# EAGLE design main (EAGLE 7.1.0)
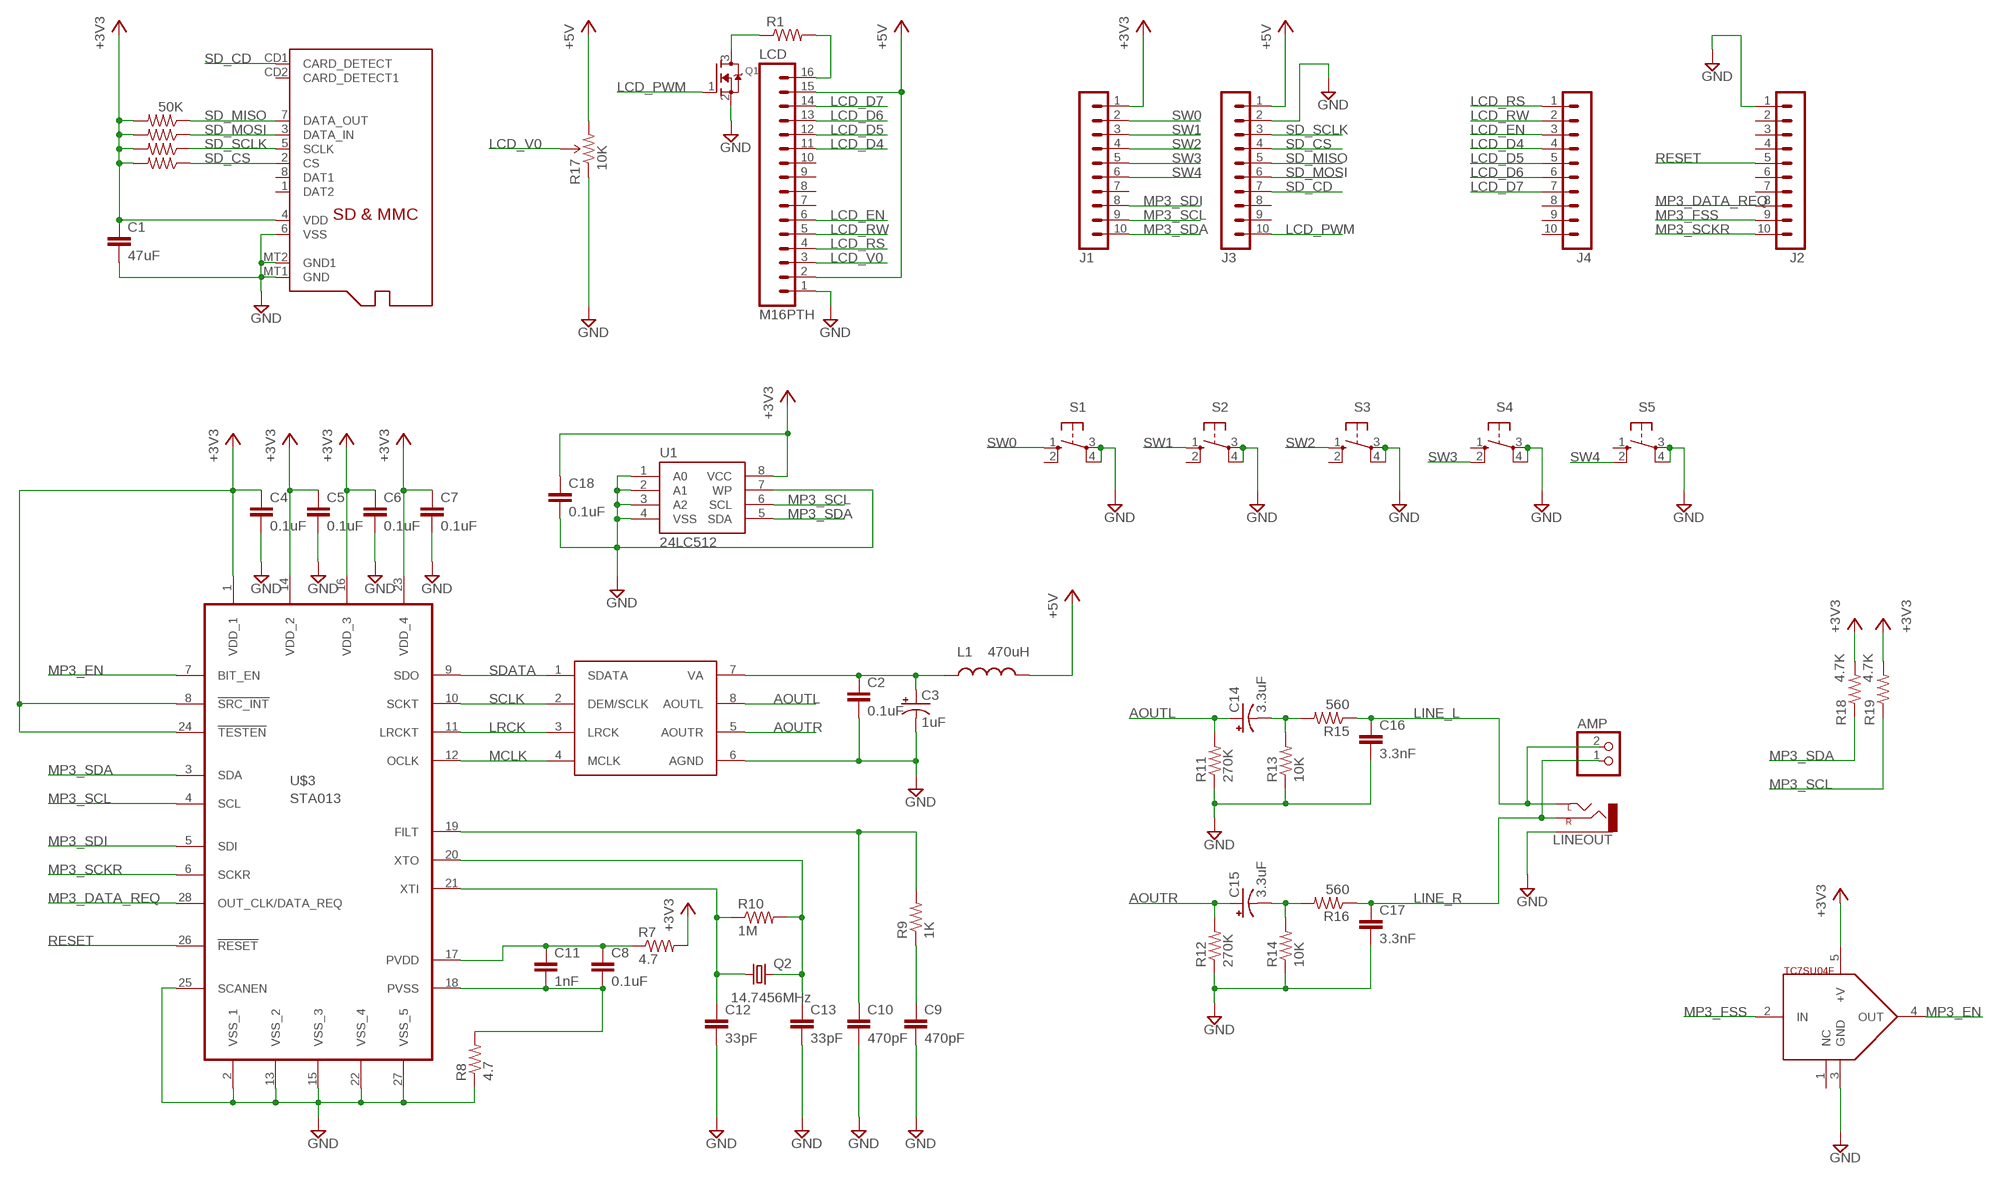
[diagram p0: schematic, sheet 1]

## Parts
AMP  JST_2PIN-THM-RA  [JST-PH-2-THM-RA]
C1  47uF  1.0UF-25V-+80/-20(0805)  [0805]
C2  0.1uF  1.0UF-25V-+80/-20(0805)  [0805]
C3  1uF  CAP_POL1206  [EIA3216]
C4  0.1uF  1.0UF-25V-+80/-20(0805)  [0805]
C5  0.1uF  1.0UF-25V-+80/-20(0805)  [0805]
C6  0.1uF  1.0UF-25V-+80/-20(0805)  [0805]
C7  0.1uF  1.0UF-25V-+80/-20(0805)  [0805]
C8  0.1uF  1.0UF-25V-+80/-20(0805)  [0805]
C9  470pF  1.0UF-25V-+80/-20(0805)  [0805]
C10  470pF  1.0UF-25V-+80/-20(0805)  [0805]
C11  1nF  1.0UF-25V-+80/-20(0805)  [0805]
C12  33pF  1.0UF-25V-+80/-20(0805)  [0805]
C13  33pF  1.0UF-25V-+80/-20(0805)  [0805]
C14  3.3uF  CAP_POL1206  [EIA3216]
C15  3.3uF  CAP_POL1206  [EIA3216]
C16  3.3nF  1.0UF-25V-+80/-20(0805)  [0805]
C17  3.3nF  1.0UF-25V-+80/-20(0805)  [0805]
C18  0.1uF  1.0UF-25V-+80/-20(0805)  [0805]
J1  MA10-1  [HEADER-10]
J2  MA10-1  [HEADER-10]
J3  MA10-1  [HEADER-10]
J4  MA10-1  [HEADER-10]
L1  470uH  INDUCTORSRR7032  [SRR7032]
LCD  M16PTH  [1X16]
LINEOUT  AUDIO-JACKPTH  [AUDIO-JACK]
Q1  MOSFET-NREFLOW  [SOT23]
Q2  14.7456MHz  CRYSTALHC49UP  [HC49UP]
R1  R-US_R0805  [R0805]
R3  50K  R-US_R0805  [R0805]
R4  50K  R-US_R0805  [R0805]
R5  50K  R-US_R0805  [R0805]
R6  50K  R-US_R0805  [R0805]
R7  4.7  R-US_R0805  [R0805]
R8  4.7  R-US_R0805  [R0805]
R9  1K  R-US_R0805  [R0805]
R10  1M  R-US_R0805  [R0805]
R11  270K  R-US_R0805  [R0805]
R12  270K  R-US_R0805  [R0805]
R13  10K  R-US_R0805  [R0805]
R14  10K  R-US_R0805  [R0805]
R15  560  R-US_R0805  [R0805]
R16  560  R-US_R0805  [R0805]
R17  10K  TRIMPOT3364W  [3364W]
R18  4.7K  R-US_R0805  [R0805]
R19  4.7K  R-US_R0805  [R0805]
S1  10-XX  [B3F-10XX]
S2  10-XX  [B3F-10XX]
S3  10-XX  [B3F-10XX]
S4  10-XX  [B3F-10XX]
S5  10-XX  [B3F-10XX]
U1  24LC512  EEPROM-I2CSMD  [SO08]
U$1  MICROSD  [MICROSD]
U$2  CS4334  [SO08]
U$3  STA013  [SO28W]
U$4  TC7SU04F  [SOT23-5]

## Nets
+3V3: C1.1 C4.1 C5.1 C6.1 C7.1 C18.1 J1.1 R3.2 R4.2 R5.2 R6.2 R7.2 R18.2 R19.2 U1.8(VCC) U$1.4(VDD) U$3.1(VDD_1) U$3.8(!SRC_INT) U$3.14(VDD_2) U$3.16(VDD_3) U$3.23(VDD_4) U$3.24(!TESTEN) U$4.5(+V)
+5V: J3.1 L1.P$2 LCD.2 LCD.15 R17.3(CW)
AOUTL: C14.A(+) R11.2 U$2.8(AOUTL)
AOUTR: C15.A(+) R12.2 U$2.5(AOUTR)
GND: C1.2 C2.2 C3.C(-) C4.2 C5.2 C6.2 C7.2 C9.2 C10.2 C12.2 C13.2 C16.2 C17.2 C18.2 J2.1 J3.2 LCD.1 LINEOUT.SLEEVE Q1.2(S) R8.1 R11.1 R12.1 R13.1 R14.1 R17.1(CCW) S1.3(P) S1.4(P1) S2.3(P) S2.4(P1) S3.3(P) S3.4(P1) S4.3(P) S4.4(P1) S5.3(P) S5.4(P1) U1.1(A0) U1.2(A1) U1.3(A2) U1.4(VSS) U1.7(WP) U$1.6(VSS) U$1.MT1(GND) U$1.MT2(GND1) U$2.6(AGND) U$3.2(VSS_1) U$3.13(VSS_2) U$3.15(VSS_3) U$3.22(VSS_4) U$3.25(SCANEN) U$3.27(VSS_5) U$4.3(GND)
LCD_D4: J4.4 LCD.11
LCD_D5: J4.5 LCD.12
LCD_D6: J4.6 LCD.13
LCD_D7: J4.7 LCD.14
LCD_EN: J4.3 LCD.6
LCD_PWM: J3.10 Q1.1(G)
LCD_RS: J4.1 LCD.4
LCD_RW: J4.2 LCD.5
LCD_V0: LCD.3 R17.2(WIPER)
LINE_L: AMP.2 C16.1 LINEOUT.TIP(LEFT) R15.1
LINE_R: AMP.1 C17.1 LINEOUT.RING(RIGHT) R16.1
LRCK: U$2.3(LRCK) U$3.11(LRCKT)
MCLK: U$2.4(MCLK) U$3.12(OCLK)
MP3_DATA_REQ: J2.8 U$3.28(OUT_CLK/DATA_REQ)
MP3_EN: U$3.7(BIT_EN) U$4.4(OUT)
MP3_FSS: J2.9 U$4.2(IN)
MP3_SCKR: J2.10 U$3.6(SCKR)
MP3_SCL: J1.9 R19.1 U1.6(SCL) U$3.4(SCL)
MP3_SDA: J1.10 R18.1 U1.5(SDA) U$3.3(SDA)
MP3_SDI: J1.8 U$3.5(SDI)
N$1: LCD.16 R1.2
N$2: Q1.3(D) R1.1
N$3: C8.2 C11.2 R8.2 U$3.18(PVSS)
N$4: C8.1 C11.1 R7.1 U$3.17(PVDD)
N$5: C12.1 Q2.1 R10.1 U$3.21(XTI)
N$6: C13.1 Q2.2 R10.2 U$3.20(XTO)
N$7: C10.1 R9.2 U$3.19(FILT)
N$8: C9.1 R9.1
N$9: C2.1 C3.A(+) L1.P$1 U$2.7(VA)
N$10: C14.C(-) R13.2 R15.2
N$12: C15.C(-) R14.2 R16.2
RESET: J2.5 U$3.26(!RESET)
SCLK: U$2.2(DEM/SCLK) U$3.10(SCKT)
SD_CD: J3.7 U$1.CD1(CARD_DETECT)
SD_CS: J3.4 R6.1 U$1.2(CS)
SD_MISO: J3.5 R3.1 U$1.7(DATA_OUT)
SD_MOSI: J3.6 R4.1 U$1.3(DATA_IN)
SD_SCLK: J3.3 R5.1 U$1.5(SCLK)
SDATA: U$2.1(SDATA) U$3.9(SDO)
SW0: J1.2 S1.1(S)
SW1: J1.3 S2.1(S)
SW2: J1.4 S3.1(S)
SW3: J1.5 S4.2(S1)
SW4: J1.6 S5.2(S1)
Unconnected: J1.7 J2.2 J2.3 J2.4 J2.6 J2.7 J3.8 J3.9 J4.8 J4.9 J4.10 LCD.7 LCD.8 LCD.9 LCD.10 S1.2(S1) S2.2(S1) S3.2(S1) S4.1(S) S5.1(S) U$1.1(DAT2) U$1.8(DAT1) U$1.CD2(CARD_DETECT1) U$4.1(NC)

## Library data of the parts
AMP = adafruit:JST_2PIN: JST 2-Pin Connectors of various flavors SMT-RA (S2B-PH-SM4) 4UConnector #17311 SMT (B2B-PH-SM4) THM-RA (S2B-PH) THM (B2B-PH)
C1 C2 C4-C13 C16-C18 = SparkFun-Capacitors:1.0UF-25V-+80/-20(0805): CAP-11625; PROD_ID: CAP-11625; VALUE: 1.0uF
C3 C14 C15 = SparkFun-Capacitors:CAP_POL: Capacitor Polarized These are standard SMD and PTH capacitors. Normally 10uF, 47uF, and 100uF in electrolytic and tantalum varieties. Always verify the external diameter of the through hole cap, it varies with capacity, voltage, and manufacturer. The EIA devices should be standard.
J1-J4 = custom-spave:MA10-1: PIN HEADER
L1 = custom-spave:INDUCTOR: Inductors Basic Inductor/Choke - 0603 and 1206. Footprints are not proven and vary greatly between part numbers. SRN6045- 33uH, 20% 1.4A SDR0403-560KL - 56uH, 10%, 500mA RMS/740mA peak
LCD = SparkFun-Connectors:M16: 1x16 .1" header
LINEOUT = SparkFun-Connectors:AUDIO-JACK: 3.5mm Audio Jack Simple 3.5mm common PCB mount audio jack. SKU: PRT-08032
Q1 = adafruit:MOSFET-N: N-Channel Mosfet 2N7002E - 60V 260mA SOT23 [Digikey: 2N7002ET1GOSTR-ND] - REEL BSH103 - 30V 850mA SOT23 [Digikey: 568-5013-1-ND]
Q2 = adafruit:CRYSTAL: CRYSTAL; OC_FARNELL: unknown; OC_NEWARK: unknown
R1 R3-R16 R18 R19 = adafruit:R-US_: RESISTOR, American symbol
R17 = custom-spave:TRIMPOT: Various small potentiometers for "set-and-forget" applications
S1-S5 = switch-omron:10-XX: OMRON SWITCH; MPN: B3F-1000; OC_FARNELL: 176432; OC_NEWARK: 36M3542
U1 = SparkFun-DigitalIC:EEPROM-I2C: I2C EEPROM chips, 24LC256 (and others)
U$1 = adafruit:MICROSD: Micro-SD / Transflash card holder with SPI pinout For the 3M # 2908-05WB-MG and/or 4UCON #19656 push-push type
U$2 = custom-spave:CS4334: 8-SOIC NMOSFET
U$3 = custom-spave:STA013
U$4 = SparkFun-DigitalIC:TC7SU04F: Single gate inverter

## Net classes
0 default: width 0.203 mm

## Board
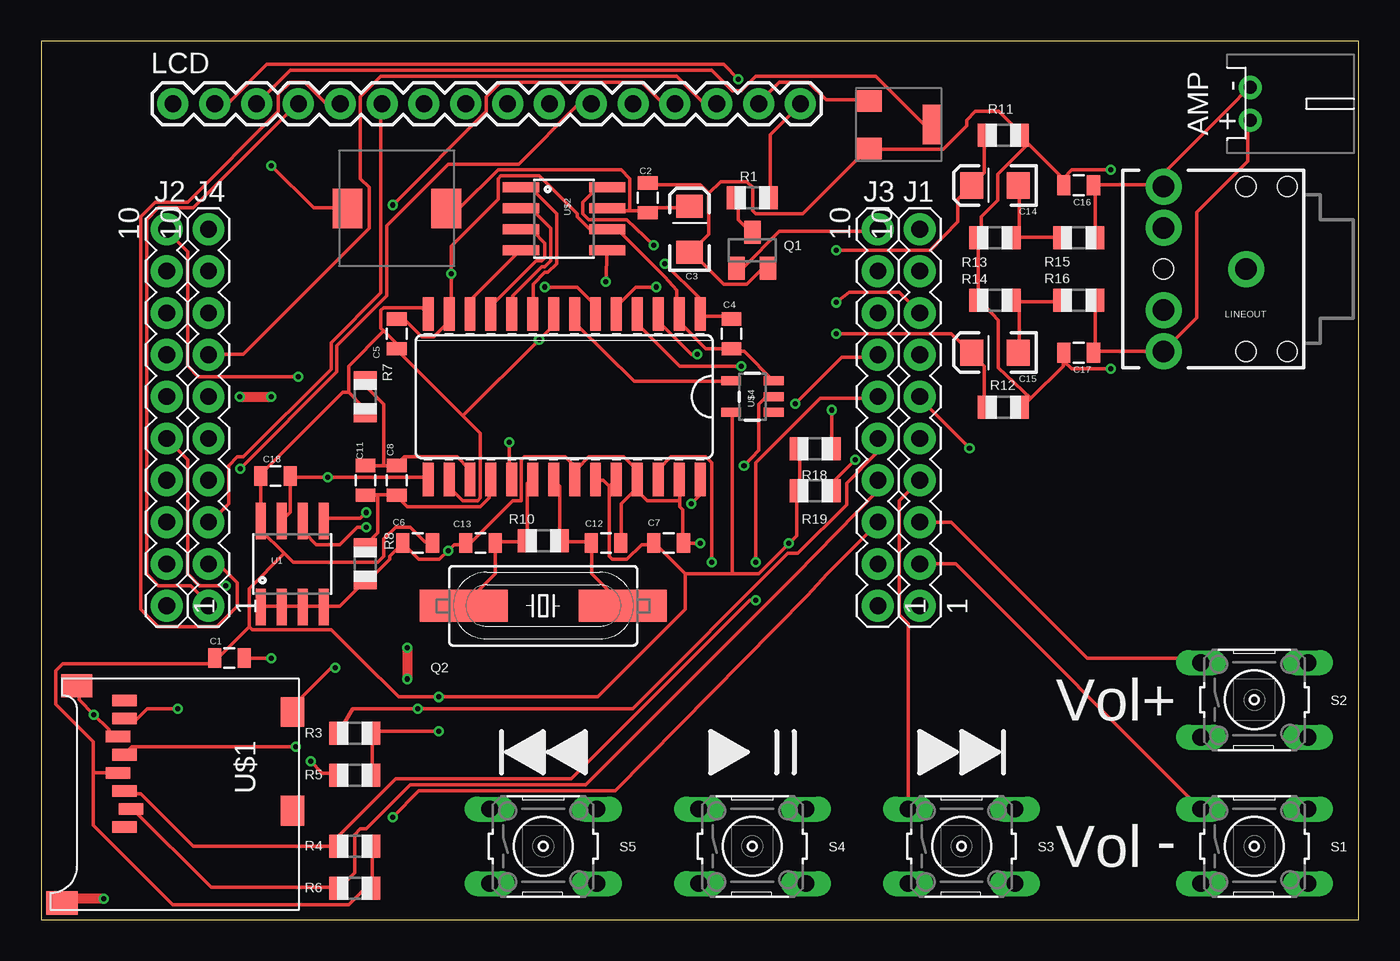
[diagram p1: board, top side]
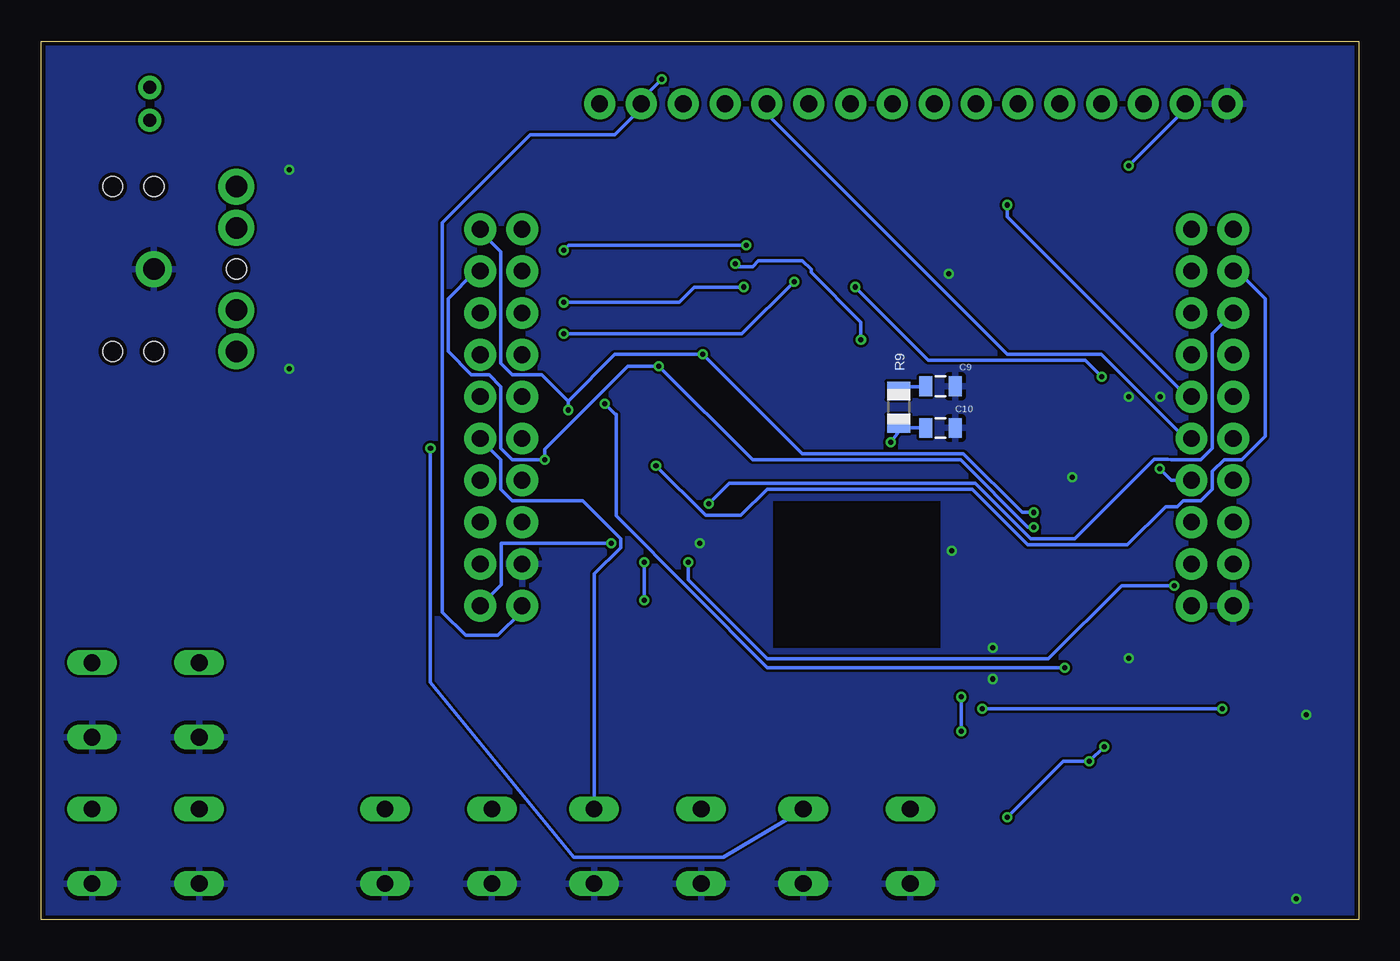
[diagram p2: board, bottom side, seen from below]

Size 80 x 53.33 mm. Coordinates in mm from the lower left corner, seen from the top.
Outline: 0,0 80,0 80,53.33 0,53.33 0,0
Copper layers (1*16): Top 0.035mm / dielectric 1.5mm / Bottom 0.035mm
Design rules "ITEADstudio_DRC": minimum track width 6mil, minimum drill 12mil, track to track 6mil, track to pad 6mil, pad to pad 6mil, via to via 6mil, smd to smd 0mil, copper to edge 10mil, drill to drill 10mil, minimum pad ring 10mil, minimum via ring 6mil, stop-mask expansion 2mil, vias tented up to drill 100mil, thermal gap 10mil
bRestrict: area 25.4,16.5 to 35.6,25.4

### Footprints (pad centres in the part's own frame; a part is rotated, then mirrored left to right if it is on the bottom)
JST-PH-2-THM-RA = drill 0.8 pad 1.422: 1 1,0; 2 -1,0
0805 = smd 0.8 x 1.2: 1 -0.9,0; 2 0.9,0
EIA3216 = smd 1.4 x 1.6: A 1.4,0; C -1.4,0
HEADER-10 = drill 1.016 pad 1.93: 1 -11.43,0; 2 -8.89,0; 3 -6.35,0; 4 -3.81,0; 5 -1.27,0; 6 1.27,0; 7 3.81,0; 8 6.35,0; 9 8.89,0; 10 11.43,0
SRR7032 = smd 2.4 x 1.8: P$1 0,3; P$2 0,-3
1X16 = drill 1.016 pad 1.88: 1 0,0; 2 2.54,0; 3 5.08,0; 4 7.62,0; 5 10.16,0; 6 12.7,0; 7 15.24,0; 8 17.78,0; 9 20.32,0; 10 22.86,0; 11 25.4,0; 12 27.94,0; 13 30.48,0; 14 33.02,0; 15 35.56,0; 16 38.1,0
AUDIO-JACK = drill 1.3 pad 2.184: RING 5,5; RSH 5,2.5; SLEEVE 0,0; TIP 5,-5; TSH 5,-2.5 | hole 1.2: 0,5; -2.5,5; -2.5,-5; 0,-5; 5,0
SOT23 = smd 1 x 1.4: 1 -0.95,-1.1; 2 0.95,-1.1; 3 0,1.1
HC49UP = smd 5.334 x 1.93: 1 -4.826,0; 2 4.826,0
R0805 = smd 1.1 x 1.4: 1 -1,0; 2 1,0
3364W = smd 1.3 x 1.5: 1 1.45,-1.8; 3 -1.45,-1.8 | smd 2.4 x 1.1: 2 0,2
B3F-10XX = drill 1.016 long: 1 -3.251,2.261; 2 3.251,2.261; 3 -3.251,-2.261; 4 3.251,-2.261
SO08 = smd 0.61 x 2.21: 1 -1.905,-2.616; 2 -0.635,-2.616; 3 0.635,-2.616; 4 1.905,-2.616; 5 1.905,2.616; 6 0.635,2.616; 7 -0.635,2.616; 8 -1.905,2.616
MICROSD = smd 0.7 x 1.5: 1 9,-10.64; 2 7.9,-10.24; 3 6.8,-10.64; 4 5.7,-11.04; 5 4.6,-10.64; 6 3.5,-11.04; 7 2.4,-10.64; 8 1.3,-10.64 | smd 1.8 x 1.4: CD1 2,-0.44; CD2 8,-0.44 | smd 1.4 x 1.9: MT1 0.4,-13.54; MT2 13.6,-14.44
SO28W = smd 0.66 x 2.032: 1 -8.255,-5.029; 2 -6.985,-5.029; 3 -5.715,-5.029; 4 -4.445,-5.029; 5 -3.175,-5.029; 6 -1.905,-5.029; 7 -0.635,-5.029; 8 0.635,-5.029; 9 1.905,-5.029; 10 3.175,-5.029; 11 4.445,-5.029; 12 5.715,-5.029; 13 6.985,-5.029; 14 8.255,-5.029; 15 8.255,5.029; 16 6.985,5.029; 17 5.715,5.029; 18 4.445,5.029; 19 3.175,5.029; 20 1.905,5.029; 21 0.635,5.029; 22 -0.635,5.029; 23 -1.905,5.029; 24 -3.175,5.029; 25 -4.445,5.029; 26 -5.715,5.029; 27 -6.985,5.029; 28 -8.255,5.029
SOT23-5 = smd 0.55 x 1.2: 1 -0.95,-1.3; 2 0,-1.3; 3 0.95,-1.3; 4 0.95,1.3; 5 -0.95,1.3

### Placement (x,y rotation side)
AMP  73.41,49.53 270 top
C1  11.43,15.88 0 top
C2  36.83,43.81 90 top
C3  39.37,41.91 90 top
C4  41.91,35.56 270 top
C5  21.59,35.56 90 top
C6  22.86,22.86 180 top
C7  38.1,22.86 0 top
C8  21.59,26.67 270 top
C9  25.4,32.38 0 bottom
C10  25.4,29.84 0 bottom
C11  19.68,26.67 270 top
C12  34.29,22.86 0 top
C13  26.67,22.86 180 top
C14  57.91,44.58 180 top
C15  57.91,34.42 180 top
C16  62.99,44.58 180 top
C17  62.99,34.42 180 top
C18  14.22,26.92 0 top
J1  53.34,30.48 90 top
J2  7.62,30.48 90 top
J3  50.8,30.48 90 top
J4  10.16,30.48 90 top
L1  21.59,43.18 270 top
LCD  8,49.53 0 top
LINEOUT  73.15,39.5 180 top
Q1  43.18,40.64 0 top
Q2  30.48,19.05 180 top
R1  43.18,43.81 0 top
R3  19.05,11.3 0 top
R4  19.05,4.45 0 top
R5  19.05,8.76 0 top
R6  19.05,1.91 0 top
R7  19.68,31.75 270 top
R8  19.68,21.59 90 top
R9  27.94,31.11 270 bottom
R10  30.48,22.99 180 top
R11  58.42,47.62 180 top
R12  58.42,31.11 180 top
R13  57.91,41.4 0 top
R14  57.91,37.59 0 top
R15  62.99,41.4 180 top
R16  62.99,37.59 180 top
R17  52.07,48.26 270 top
R18  46.99,28.57 180 top
R19  46.99,26.04 180 top
S1  73.66,4.45 0 top
S2  73.66,13.34 0 top
S3  55.88,4.45 0 top
S4  43.18,4.45 0 top
S5  30.48,4.45 0 top
U1  15.24,21.59 0 top
U$1  15.7,14.61 270 top
U$2  31.75,42.55 270 top
U$3  31.75,31.75 180 top
U$4  43.18,31.75 90 top

### Tracks (layer width: path | path; a pad name or v marks a point on that pad's centre or on a via)
+3V3  (via drill 0.3)
  Top 0.203: 41.96,36.45 C4.1 41.78,36.63 40.01,36.63 U$3.1 40.01,37.69 v37.87,39.83 | R18.2 46.05,28.45 46.05,26.14 R19.2 45.87,25.96 45.87,23.29 45.58,23 | 34.49,26.31 34.49,22.05 34.67,21.87 35.56,21.87 36.45,22.76 37.16,22.76 C7.1 37.34,22.76 39.12,20.98 | 34.49,26.31 34.85,26.67 U$3.24 | 34.49,26.31 34.14,26.67 33.78,26.67 U$3.23 | 45.58,23 43.56,20.98 41.96,20.98 | 39.12,20.98 41.96,20.98 | 41.96,20.98 41.96,30.76 U$4.5 | 20.8,35.74 20.62,35.92 20.62,36.98 20.8,37.16 23.11,37.16 U$3.14 | 20.8,35.74 21.51,35.03 21.51,34.67 C5.1 21.69,34.49 25.6,30.58 | 18.67,32 19.56,31.11 19.56,30.76 R7.2 | 18.67,32 18.67,33.6 20.8,35.74 | 25.6,30.58 26.67,29.52 26.67,25.6 26.49,25.43 25.6,25.43 24.89,26.14 24.89,26.67 U$3.16 | U$3.8 31.11,36.09 v30.23,35.2 25.6,30.58 | R5.2 20.09,8.89 20.09,11.2 R3.2 20.09,11.38 20.45,11.38 19.81,11.56 20.32,11.43 v24.13,11.43 | R4.2 20.09,4.45 20.09,1.96 R6.2 19.91,1.78 19.56,1.78 18.67,0.89 8,0.89 3.17,5.71 3.17,8.9 | 14.76,22.23 13.34,23.65 U1.8 13.34,26.85 C18.1 13.34,27.03 18.31,32 18.67,32 | 14.76,22.23 15.29,21.69 20.45,21.69 20.8,22.05 20.8,23.11 21.51,23.82 22.4,23.82 23.29,22.94 23.65,22.94 C6.1 | 12.62,17.78 12.8,17.6 17.6,17.6 19.91,15.29 21.18,14.05 21.72,13.51 v24.13,13.51 33.78,13.51 39.12,18.85 39.12,20.98 | 12.62,17.78 12.62,20.09 14.76,22.23 | 3.17,8.9 3.17,10.79 0.89,13.08 0.89,15.11 1.29,15.52 3.81,15.52 | 3.81,15.52 10.36,15.52 10.72,15.88 | 12.62,17.78 10.72,15.88 | v45.39,22.86 45.53,23 45.58,23 | U$1.4 3.17,8.9 | 3.8,15.53 3.81,15.52 | C1.1 10.72,15.88
  Bottom 0.203: J1.1 52.07,20.32 52.07,22.86 v45.39,22.86 | v24.13,13.51 v24.13,11.43 | v30.23,35.2 30.23,36.27 33.25,39.29 33.25,39.47 33.78,40.01 36.45,40.01 36.8,39.65 37.69,39.65 v37.87,39.83
+5V  (via drill 0.3)
  Top 0.203: v13.97,45.77 16.54,43.2 18.49,43.2 L1.P$2 | R17.3 50.14,49.78 47.65,49.78 46.58,50.85 44.81,50.85 43.56,49.61 LCD.15 | v42.32,51.03 41.43,51.92 13.69,51.92 11.38,49.61 10.67,49.61 LCD.2
  Bottom 0.203: v13.97,45.77 10.67,49.07 10.67,49.43 LCD.2 | J3.1 50.85,19.02 50.85,18.67 52.27,17.25 54.23,17.25 55.65,18.67 55.65,42.32 50.32,47.65 45.16,47.65 43.38,49.43 LCD.15 43.38,49.61 43.38,49.96 v42.32,51.03
AOUTL  (via drill 0.3)
  Top 0.203: R11.2 57.25,47.47 57.25,45.34 56.54,44.63 C14.A 56.36,44.45 55.65,43.74 55.65,42.37 53.98,40.64 v48.26,40.64 | U$2.8 33.78,44.45 32.89,43.56 32.89,42.85 33.25,42.49 35.56,42.49 v37.19,40.95
  Bottom 0.203: v48.26,40.64 47.95,40.95 v37.19,40.95
AOUTR  (via drill 0.3)
  Top 0.203: R12.2 57.25,31.11 57.25,33.6 56.54,34.31 C15.A 55.24,35.56 v48.26,35.56 | v34.29,38.73 U$2.5
  Bottom 0.203: v48.26,35.56 37.47,35.56 v34.29,38.73
GND  (via drill 0.3)
  Top 0.203: U1.1 13.34,19.02 14.58,19.02 U1.2 14.76,19.02 15.82,19.02 U1.3 16,19.02 17.07,19.02 U1.4 17.25,19.02 18.14,19.02 19.56,20.45 R8.1 19.74,20.45 21.16,21.87 21.16,22.05 21.87,22.76 C6.2 22.05,22.76 22.94,21.87 24.18,21.87 v24.71,22.4 25.07,22.76 25.6,22.76 C13.2 25.78,22.94 26.14,22.94 28.63,25.43 29.16,25.43 29.16,27.91 29.34,28.09 31.83,28.09 32.54,27.38 | 38.76,25.43 38.76,26.67 U$3.27 | 38.76,25.43 38.76,25.07 38.94,24.89 38.94,22.94 C7.2 v40.01,22.86 | 36.09,26.14 35.2,25.25 35.2,22.94 C12.2 | 36.09,26.14 36.09,26.67 U$3.25 | 32.54,27.38 32.54,26.85 U$3.22 32.54,27.38 | 32.54,27.38 33.25,28.09 35.38,28.09 36.09,27.38 | 36.09,27.38 36.09,26.85 U$3.25 | 38.76,25.43 36.8,25.43 36.09,26.14 | 36.09,26.14 U$3.25 | C5.2 21.69,36.45 22.05,36.45 23.11,35.38 23.82,35.38 24.71,36.27 24.71,36.63 U$3.13 24.89,36.8 v24.89,39.22 24.89,40.89 27.74,43.74 27.74,44.98 27.91,45.16 30.23,45.16 32.54,42.85 32.54,42.67 33.25,41.96 34.31,41.96 U$2.6 34.49,41.78 35.1,41.78 37.87,39.01 38.58,38.2 38.58,36.8 U$3.2 38.76,36.63 38.76,36.27 40.36,34.67 41.78,34.67 C4.2 41.96,34.49 42.67,34.49 44.45,32.72 U$4.3 | 36.09,27.38 U$3.25 | U1.7 15.11,24.71 15.11,26.85 C18.2 15.29,26.85 v17.4,26.85 23.47,26.85 U$3.15 | 40.54,44.09 40.01,44.63 36.98,44.63 C2.2 | 40.54,44.09 40.54,41.6 39.47,40.54 | 39.47,40.54 41.43,38.58 42.85,38.58 43.74,39.47 44.09,39.47 Q1.2 | 39.47,40.54 C3.C | U$1.6 4.62,11.2 4.27,10.92 4.09,11.56 v3.2,12.45 2.31,13.34 2.31,14.05 U$1.MT1 | 60.1,31.65 59.56,31.11 R12.1 | 60.1,31.65 62.05,33.6 62.05,34.31 C17.2 | 62.05,44.98 62.05,44.63 C16.2 62.05,44.98
  Top 0.203: 59.92,47.12 59.56,47.47 R11.1 | 59.92,47.12 62.05,44.98 | v64.95,45.52 62.59,45.52 62.05,44.98 | R11.1 59.56,47.65 58.14,49.07 56.72,49.07 56.19,48.54 56.19,48.18 54.76,46.76 50.32,46.76 R17.1 50.14,46.76 46.23,42.85 43.38,42.85 43.2,43.03 43.2,44.45 42.85,44.81 41.25,44.81 40.54,44.09 | 1.25,1.07 U$1.MT2 | 59.92,47.12 58.06,45.26 58.06,43.66 57.07,42.67 57.07,41.43 R13.1 56.9,41.25 56.9,37.69 R14.1 57.07,37.52 58.12,36.4 58.12,33.5 60.1,31.65 | 59.92,47.12 R11.1 | v64.95,33.45 62.59,33.45 62.08,33.88 | C1.2 v13.97,15.88
  Top 0.61: v12.06,31.75 v13.97,31.75 | v22.23,16.51 v22.23,14.61 | v3.81,1.27 1.91,1.27 U$1.MT2
  pour Bottom: -1.27,54.61 -1.27,-1.27 81.28,-1.27 81.28,54.61
LCD_D4  (via drill 0.3)
  Top 0.203: v12.09,27.38 17.96,33.25 17.96,34.85 20.98,37.87 20.98,42.14 24.71,45.87 28.98,45.87 32.54,49.43 33.25,49.43 LCD.11
  Bottom 0.203: v12.09,27.38 11.38,26.67 J4.4
LCD_D5
  Bottom 0.203: LCD.12 35.92,49.43 35.92,48.9 21.34,34.31 15.65,34.31 10.67,29.34 10.31,29.34 J4.5
LCD_D6  (via drill 0.3)
  Top 0.203: v21.34,43.38 27.03,49.07 27.03,49.96 27.91,50.85 36.45,50.85 37.69,49.61 38.41,49.61 LCD.13
  Bottom 0.203: v21.34,43.38 21.34,42.67 10.31,31.65 J4.6
LCD_D7
  Top 0.203: LCD.14 40.89,49.61 40.18,49.61 38.58,51.21 20.62,51.21 19.38,49.96 19.38,44.98 19.91,44.45 19.91,41.96 12.27,34.31 10.31,34.31 J4.7
LCD_EN
  Top 0.203: LCD.6 20.62,49.43 20.62,38.05 17.6,35.03 17.6,33.43 12.27,28.09 11.91,28.09 11.38,27.56 11.38,25.25 10.31,24.18 J4.3
LCD_PWM
  Top 0.203: Q1.1 42.32,39.65 42.67,39.65 44.81,41.78 50.67,41.78 J3.10
LCD_RS
  Top 0.203: LCD.4 15.47,49.43 9.25,43.2 7.11,43.2 6.4,42.49 6.4,20.98 7.11,20.27 9.07,20.27 10.13,19.2 J4.1
LCD_RW
  Top 0.203: LCD.5 18.14,49.61 17.25,49.61 16,50.85 15.11,50.85 14.4,50.14 14.4,49.07 8.89,43.56 6.93,43.56 6.04,42.67 6.04,18.85 7.11,17.78 10.67,17.78 11.91,19.02 11.91,20.45 10.85,21.51 10.31,21.51 J4.2
LCD_V0
  Top 0.203: R17.2 54.05,48.36 53.52,48.36 50.67,51.21 43.38,51.21 42.49,50.32 41.96,50.32 40.72,51.56 15.11,51.56 13.16,49.61 LCD.3
LINE_L
  Top 0.203: R15.1 64.01,41.43 64.01,44.45 C16.1 64.01,44.63 67.46,44.63 | 67.46,44.63 72.62,49.78 73.25,50.49 AMP.2 | 67.46,44.63 LINEOUT.TIP
LINE_R
  Top 0.203: 64.01,34.49 64.01,37.52 R16.1 | 64.01,34.49 68.1,34.49 LINEOUT.RING 68.28,34.67 70.16,36.55 70.16,42.95 73.25,46.05 73.25,48.36 AMP.1 | 64.01,34.49 C17.1
LRCK
  Top 0.203: U$3.11 27.38,36.8 27.38,37.34 30.05,40.01 30.4,40.01 30.58,40.18 30.58,41.07 29.87,41.78 29.16,41.78 U$2.3
MCLK
  Top 0.203: U$3.12 26.14,36.8 26.14,37.69 28.98,40.54 U$2.4
MP3_DATA_REQ  (via drill 0.3)
  Top 0.203: U$3.28 40.01,25.78 v39.47,25.25
  Bottom 0.203: v39.47,25.25 38.23,26.49 23.29,26.49 19.91,23.11 17.25,23.11 12.42,27.94 11.61,27.94 11.38,27.91 9.6,27.91 8.89,28.63 8.89,35.56 J2.8
MP3_EN
  Top 0.203: U$3.7 32.54,36.63 32.54,36.09 36.02,32.69 41.97,32.69 U$4.4
MP3_FSS  (via drill 0.3)
  Top 0.203: v42.67,27.56 43.56,28.5 43.56,31.29 43.92,31.65 44.45,31.65 U$4.2
  Bottom 0.203: v42.67,27.56 39.65,24.54 37.52,24.54 35.92,26.14 23.47,26.14 20.09,22.76 14.05,22.76 11.73,25.07 11.02,25.07 10.67,25.43 9.6,25.43 8.89,26.14 8.89,27.2 8.18,27.91 7.11,27.91 5.69,29.34 5.69,37.69 7.47,39.47 J2.9
MP3_SCKR  (via drill 0.3)
  Top 0.203: v30.58,38.41 32.54,38.41 33.6,37.34 33.6,36.8 U$3.6 | v15.62,32.97 9.55,32.97 8.89,33.63 8.89,40.54 7.64,41.78 J2.10
  Bottom 0.203: v30.58,38.41 26.14,33.96 16.61,33.96 v15.62,32.97
MP3_SCL  (via drill 0.3)
  Top 0.203: v49.43,27.91 48.01,26.49 48.01,26.14 R19.1 | v42.49,33.6 38.76,33.6 36.27,36.09 36.27,36.63 U$3.4 | v19.74,23.82 19.2,23.82 18.14,22.76 16.71,22.76 16,23.47 16,24.18 U1.6
  Bottom 0.203: J1.9 53.34,39.29 53.7,39.29 55.3,37.69 55.3,34.49 53.87,33.07 52.81,33.07 52.09,32.36 52.09,28.63 51.38,27.91 v49.43,27.91 49.43,28.55 44.37,33.6 v42.49,33.6 36.8,27.91 24.18,27.91 20.09,23.82 v19.74,23.82
MP3_SDA  (via drill 0.3)
  Top 0.203: v48.01,30.94 48.01,28.63 R18.1 | v39.83,34.31 39.47,34.31 37.52,36.27 37.52,36.63 U$3.3 | v19.74,24.71 19.38,24.36 17.25,24.36 U1.5
  Bottom 0.203: 48.01,31.47 v48.01,30.94 | 48.01,31.47 49.61,33.07 51.38,33.07 52.09,33.78 52.09,40.54 53.34,41.78 J1.10 | 48.01,31.47 45.16,34.31 v39.83,34.31 33.78,28.27 24,28.27 20.45,24.71 v19.74,24.71
MP3_SDI  (via drill 0.3)
  Top 0.203: v37.34,38.41 36.09,38.41 35.03,37.34 35.03,36.8 U$3.5 | J1.8 53.34,36.8 52.09,38.1 49.05,38.1 v48.26,37.47
  Bottom 0.203: v37.34,38.41 40.34,38.41 41.27,37.47 v48.26,37.47
N$1
  Top 0.203: R1.2 44.27,43.92 44.27,47.65 46.05,49.43 LCD.16
N$2
  Top 0.203: R1.1 42.32,43.74 42.32,42.49 43.03,41.78 Q1.3
N$3
  Top 0.203: 20.45,25.78 21.51,25.78 C8.2 21.69,25.6 22.23,25.07 26.67,25.07 27.2,25.6 27.2,26.67 U$3.18 | 20.45,25.78 19.74,25.78 C11.2 | 20.45,25.78 20.45,23.47 19.74,22.76 R8.2
N$4
  Top 0.203: 20.8,27.56 21.51,27.56 C8.1 21.69,27.74 22.05,28.09 25.25,28.09 25.96,27.38 25.96,26.85 U$3.17 | 20.8,27.56 19.74,27.56 C11.1 | 20.8,27.56 20.8,31.29 19.74,32.36 19.74,32.72 R7.1
N$5
  Top 0.203: U$3.21 31.11,26.67 31.47,26.31 31.47,23.11 R10.1 31.65,22.94 33.25,22.94 C12.1 33.43,22.76 33.43,20.98 35.2,19.2 Q2.1
N$6
  Top 0.203: U$3.20 29.69,26.67 29.52,26.49 29.52,23.11 R10.2 29.34,22.94 27.74,22.94 C13.1 27.56,22.76 27.56,20.98 25.78,19.2 Q2.2
N$7  (via drill 0.3)
  Top 0.203: v28.42,28.98 28.42,28.09 28.45,27.38 28.45,26.85 U$3.19
  Bottom 0.203: 27.74,29.87 26.31,29.87 C10.1 | 27.74,29.87 27.91,30.05 R9.2 27.74,29.87 | v28.42,28.98 27.74,29.87
N$8
  Bottom 0.203: C9.1 26.31,32.36 27.74,32.36 27.91,32.18 R9.1
N$9
  Top 0.203: 35.74,43.03 34.49,43.03 U$2.7 | 35.74,43.03 36.8,43.03 C2.1 36.98,43.03 37.16,43.2 39.29,43.2 C3.A | 35.74,43.03 35.74,44.98 35.2,45.52 27.74,45.52 25.43,43.2 24.71,43.2 L1.P$1
N$10
  Top 0.203: 59.38,41.43 61.87,41.43 R15.2 | 59.38,41.43 59.03,41.43 R13.2 59.38,41.43 | 59.38,41.43 59.38,44.45 C14.C
N$12
  Top 0.203: 59.38,37.52 61.87,37.52 R16.2 | 59.38,37.52 59.03,37.52 R14.2 59.38,37.52 | 59.38,37.52 59.38,34.49 C15.C
RESET  (via drill 0.3)
  Top 0.203: v40.72,21.69 40.72,27.74 40.36,28.09 38.23,28.09 37.52,27.38 37.52,26.85 U$3.26 | v11.2,20.27 9.6,20.27 8.89,20.98 8.89,27.91 7.64,29.16 J2.5
  Bottom 0.203: v40.72,21.69 40.72,20.62 35.92,15.82 18.85,15.82 14.4,20.27 v11.2,20.27
SCLK
  Top 0.203: U$3.10 28.63,36.8 28.63,37.87 30.4,39.65 30.58,39.65 30.94,40.01 30.94,41.96 29.87,43.03 29.16,43.03 U$2.2
SD_CD  (via drill 0.3)
  Top 0.203: v17.86,15.29 17.6,15.29 15.29,12.98 15.29,12.62 U$1.CD1 | v45.77,31.32 46.76,32.28 48.62,34.14 50.67,34.14 J3.7
  Bottom 0.203: v17.86,15.29 35.92,15.29 45.09,24.51 45.09,30.68 45.14,30.68 v45.77,31.32
SD_CS
  Top 0.203: U$1.2 5.51,6.76 10.31,1.96 17.96,1.96 R6.1 18.14,1.96 19.02,2.85 19.02,5.16 19.38,5.51 19.74,5.51 22.4,8.18 33.07,8.18 45.7,20.8 45.77,20.9 50.8,26.04 J3.4
SD_MISO  (via drill 0.3)
  Top 0.203: J3.5 50.67,29.16 50.67,28.27 48.9,26.49 48.9,25.17 45.95,22.23 45.34,22.23 35.92,12.8 v22.86,12.8 18.92,12.8 R3.1 | U$1.7 5.71,12.06 6.45,12.8 v8.31,12.8
  Bottom 0.203: v8.31,12.8 v22.86,12.8
SD_MOSI  (via drill 0.3)
  Top 0.203: R4.1 9.25,4.45 6.04,7.64 5.16,7.64 U$1.3 | v43.38,21.69 43.38,27.74 47.3,31.65 50.67,31.65 J3.6 | v43.38,19.38 43.03,19.38 32.18,8.53 21.51,8.53 17.96,4.98 R4.1 | 18.14,4.45 R4.1
  Bottom 0.203: v43.38,19.38 v43.38,21.69
SD_SCLK  (via drill 0.3)
  Top 0.203: v16.36,9.6 17.07,8.89 17.96,8.89 R5.1 | v15.47,10.49 5.51,10.49 5.16,10.13 U$1.5 | v21.34,6.22 22.94,7.82 34.85,7.82 46.51,19.66 47.73,20.98 50.04,23.29 50.67,24 J3.3
  Bottom 0.203: v15.47,10.49 v16.36,9.6 17.96,9.6 v21.34,6.22
SDATA
  Top 0.203: U$2.1 29.69,44.45 31.29,42.85 31.29,39.83 30.76,39.29 30.58,39.29 29.87,38.58 29.87,36.8 U$3.9
SW0
  Top 0.203: J1.2 55.52,21.59 S1.1
SW1
  Top 0.203: J1.3 55.24,24.13 63.5,15.88 70.13,15.88 S2.1
SW2
  Top 0.203: S3.1 52.63,17.96 52.09,18.49 52.09,25.43 J1.4
SW3
  Bottom 0.203: S4.2 46.41,6.76 46.41,20.98 44.81,22.58 44.81,23.11 47.12,25.43 51.38,25.43 52.09,26.14 52.09,27.91 53.34,29.16 J1.5
SW4  (via drill 0.3)
  Top 0.203: v56.36,28.63 53.34,31.65 J1.6
  Bottom 0.203: v56.36,28.63 56.36,14.4 47.65,3.79 38.58,3.79 33.88,6.58 33.78,6.58 S5.2

### Text on the board
tSilk: Vol+ | - | Vol